# EAGLE design 5v1_5a (EAGLE 5.11)
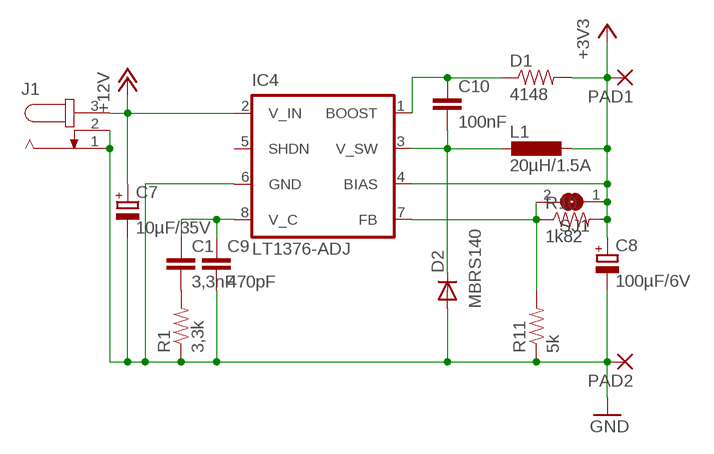
[diagram p0: schematic, sheet 1]

## Parts
C1  3,3nF  CAP0805  [0805]
C7  10µF/35V  CPOL-EUSMCD  [SMC_D]
C8  100µF/6V  CPOL-EUSMCD  [SMC_D]
C9  470pF  CAP0805  [0805]
C10  100nF  CAP0805  [0805]
D1  4148  RESISTOR1206  [1206]
D2  MBRS140  DIODE-SMB  [SMB]
IC4  LT1376-ADJ  LT1376  [SO-08]
J1  JACK-PLUG0  [SPC4077]
L1  20µH/1.5A  DO3316P  [DO3316P]
PAD1  SMD5  [SMD2,54-5,08]
PAD2  SMD5  [SMD2,54-5,08]
R1  3,3k  RESISTOR  [0805]
R10  1k82  RESISTOR  [0805]
R11  5k  RESISTOR  [0805]
SJ1  SJ  [SJ]

## Nets
+12V: C7.+ IC4.2(V_IN) J1.3
GND: C7.- C8.- C9.2 D2.A IC4.6(GND) J1.1 J1.2 PAD2.1(P) R1.1 R11.1
N$1: C1.2 R1.2
N$10: IC4.7(FB) R10.1 R11.2 SJ1.2
N$56: C1.1 C9.1 IC4.8(V_C)
N$57: C10.2 D2.C IC4.3(V_SW) L1.1
N$58: C10.1 D1.1 IC4.1(BOOST)
VCC: C8.+ D1.2 IC4.4(BIAS) L1.2 PAD1.1(P) R10.2 SJ1.1 ; supply symbol labelled +3V3
Unconnected: IC4.5(SHDN)

## Library data of the parts
C1 C9 C10 = SparkFun:CAP: Capacitor Standard 0603 ceramic capacitor, and 0.1" leaded capacitor.
C7 C8 = resistor:CPOL-EU: POLARIZED CAPACITOR, European symbol
D1 R1 R10 R11 = SparkFun:RESISTOR: Resistor Basic schematic elements and footprints for 0603, 1206, and PTH 1/10th watt (small) resistors.
D2 = diode:DIODE-: DIODE
IC4 = v-reg:LT1376
J1 = con-jack:JACK-PLUG: DC POWER JACK Power Jack, DC, Right Angle, Through Hole, Rated 5A at 16VDC, PC Terminals Distributor: Farnell (www.Farnell.de) Drawing: 84N1161.pdf / 84N1162.pdf Manufacturer: SPC Technology (www.spctechnology.com) Type: SPC4077 / SPC 4078
L1 = inductor-coilcraft:DO3316P: COILCRAFT; OC_FARNELL: unknown; OC_NEWARK: unknown
PAD1 PAD2 = wirepad:SMD5: SMD PAD
SJ1 = jumper:SJ: SMD solder JUMPER

## Board
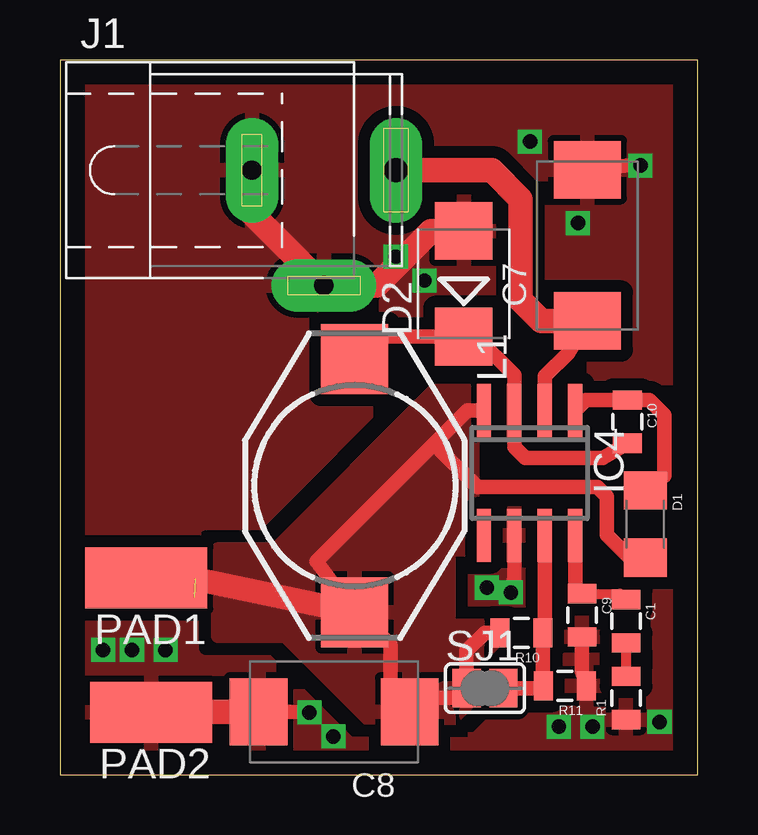
[diagram p1: board, top side]
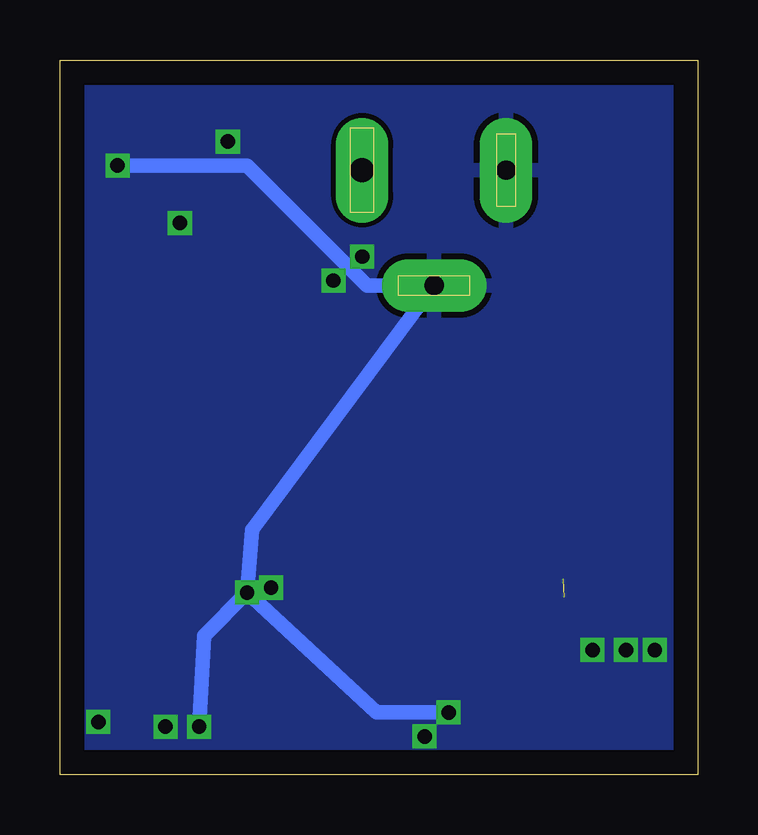
[diagram p2: board, bottom side, seen from below]

Size 26.6 x 29.8 mm. Coordinates in mm from the lower left corner, seen from the top.
Outline: 0,0 26.6,0 26.6,29.8 0,29.8 0,0
Copper layers (1*16): Top 0.035mm / dielectric 1.5mm / Bottom 0.035mm
Design rules "default *": minimum track width 10mil, minimum drill 24mil, track to track 8mil, track to pad 8mil, pad to pad 8mil, via to via 8mil, smd to smd 8mil, copper to edge 40mil, drill to drill 8mil, minimum pad ring 10mil, minimum via ring 8mil, stop-mask expansion 4mil, vias tented up to drill 24mil, thermal gap 10mil

### Footprints (pad centres in the part's own frame; a part is rotated, then mirrored left to right if it is on the bottom)
0805 = smd 0.8 x 1.2: 1 -0.9,0; 2 0.9,0
SMC_D = smd 2.4 x 2.8: + -3.15,0; - 3.15,0
1206 = smd 1.6 x 1.8: 1 -1.4,0; 2 1.4,0
SMB = smd 2.4 x 2.4: A 2.2,0; C -2.2,0
SO-08 = smd 0.6 x 2.2: 1 -1.905,-2.6; 2 -0.635,-2.6; 3 0.635,-2.6; 4 1.905,-2.6; 5 1.905,2.6; 6 0.635,2.6; 7 -0.635,2.6; 8 -1.905,2.6
SPC4077 = drill 0.8 pad 2.184 long: 1 -3,0; 2 0,-4.8 | drill 1 pad 2.184 long: 3 3,0
DO3316P = smd 2.92 x 2.79: 1 -5.28,0; 2 5.28,0
SMD2,54-5,08 = smd 2.54 x 5.08: 1 0,0
SJ = smd 1.168 x 1.6: 1 -0.762,0; 2 0.762,0

### Placement (x,y rotation side)
C1  23.6,6.4 270 top
C7  21.99,22.07 90 top
C8  11.43,2.62 180 top
C9  21.77,6.65 270 top
C10  23.66,14.72 270 top
D1  24.4,10.45 270 top
D2  16.84,20.47 90 top
IC4  19.58,12.58 180 top
J1  11,25.2 0 top
L1  12.29,12.05 270 top
PAD1  3.6,8.2 90 top
PAD2  3.8,2.6 90 top
R1  23.6,3.2 90 top
R10  19.24,5.91 180 top
R11  21.05,3.71 180 top
SJ1  17.72,3.61 0 top

### Tracks (layer width: path | path; a pad name or v marks a point on that pad's centre or on a via)
+12V
  Top 0.61: IC4.2 20.21,16.62 21.19,17.59 C7.+
  Top 1.016: J1.3 18,25.2 19.2,24 19.2,19.8 20.08,18.92 C7.+
GND  (via drill 0.6)
  Top 0.61: C9.2 21.77,4.29 R11.1 | IC4.6 18.95,8.14 v18.8,7.6 | C8.- 9.58,2.62 v10.4,2.6 | C7.- 23.78,25.42 v24.2,25.4
  Top 1.016: PAD2.1 3.02,2.62 C8.- | J1.1 8,23.4 J1.2 13.2,20.4 15.47,22.67 D2.A
  Bottom 0.61: v18.8,7.6 18.6,10.2 J1.2 13.8,20.4 18.8,25.4 v24.2,25.4 | v20.8,2 20.6,5.8 v18.8,7.6 | v10.4,2.6 13.4,2.6 v18.8,7.6
  other vias: 21.6,23 19.6,26.4 14,21.6 1.8,5.2 3,5.2 22.2,2 25,2.2 15.2,20.6 4.4,5.2 17.8,7.8 11.4,1.6
  pour Bottom: 0,29.8 26.6,29.8 26.6,0 0,0
  pour Top (isolate 0.5, rank 2): 0,0 26.6,0 26.6,29.8 0,29.8
N$1
  Top 0.406: C1.2 R1.2
N$10
  Top 0.61: IC4.7 20.21,6.19 R10.1 20.14,4.12 R11.2 20.05,3.61 SJ1.2
N$56
  Top 0.406: C9.1 23.35,7.55 C1.1
  Top 0.61: C9.1 21.48,7.77 IC4.8
N$57
  Top 0.61: L1.1 11.63,18.27 D2.C 17.33,18.27 18.95,16.66 IC4.3 18.95,13.65 19.4,13.2 22.64,13.2 C10.2
N$58
  Top 0.61: IC4.1 21.93,15.62 C10.1 24.58,15.62 25.2,15 25.2,12.45 D1.1
VCC  (1 unrouted)
  Top 0.61: 15.6,13.8 10.69,8.89 L1.2 12.43,6.77 13.78,5.42 13.78,3.2 | 15.6,13.8 16.98,15.18 IC4.4 | R10.2 17.71,5.91 16.96,5.16 SJ1.1 16.55,3.2 13.78,3.2 | 13.78,3.2 C8.+ | D1.2 23.75,9.05 22.8,10 22.8,11.6 22.4,12 17.4,12 15.6,13.8 | 5.8,9 5.6,9 5.6,7.4
  Top 1.016: PAD1.1 5.63,8.17 L1.2
  pour Top (isolate 0.5): 6.6,5.8 9.4,5.8 13.6,1.6 15.6,1.6 17,3 17,4.4 18.2,5.6 18.2,6.2 16.2,6.2 16.2,9.4 17.2,9.4 17.2,16 15.6,16 9,9.4 6.6,9.4

### Text on the board
tStop: +
bStop: + | -